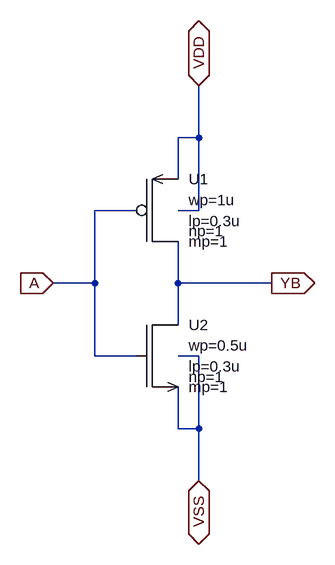
[diagram p0: schematic inv1_33.asc]
inv1_33.asc, the LTspice schematic file:
Version 4
SHEET 1 512 800
WIRE 320 176 320 96
WIRE 320 176 288 176
WIRE 288 240 288 176
WIRE 224 288 160 288
WIRE 320 288 320 176
WIRE 320 288 288 288
WIRE 160 400 160 288
WIRE 160 400 96 400
WIRE 288 400 288 336
WIRE 432 400 288 400
WIRE 288 464 288 400
WIRE 160 512 160 400
WIRE 224 512 160 512
WIRE 320 512 288 512
WIRE 288 624 288 560
WIRE 320 624 320 512
WIRE 320 624 288 624
WIRE 320 704 320 624
FLAG 432 400 YB
IOPIN 432 400 Out
FLAG 320 704 VSS
IOPIN 320 704 BiDir
FLAG 320 96 VDD
IOPIN 320 96 BiDir
FLAG 96 400 A
IOPIN 96 400 In
SYMBOL gfmcu_pmos3p3 224 288 R0
SYMATTR Value wp=1u
SYMATTR InstName U1
SYMATTR Value2 lp=0.3u
SYMBOL gfmcu_nmos3p3 224 512 R0
SYMATTR Value wp=0.5u
SYMATTR InstName U2
SYMATTR Value2 lp=0.3u

The netlist it stands for:
* inv1_33.asc
XU1 YB A VDD VDD gfmcu_pmos3p3 wp=1u lp=0.3u np=1 mp=1  ; pins ND NG NS NB
XU2 YB A VSS VSS gfmcu_nmos3p3 wp=0.5u lp=0.3u np=1 mp=1  ; pins ND NG NS NB
.lib FREE180nm.model
.backanno
.end